# EAGLE design midi-servo (EAGLE 7.3.0)
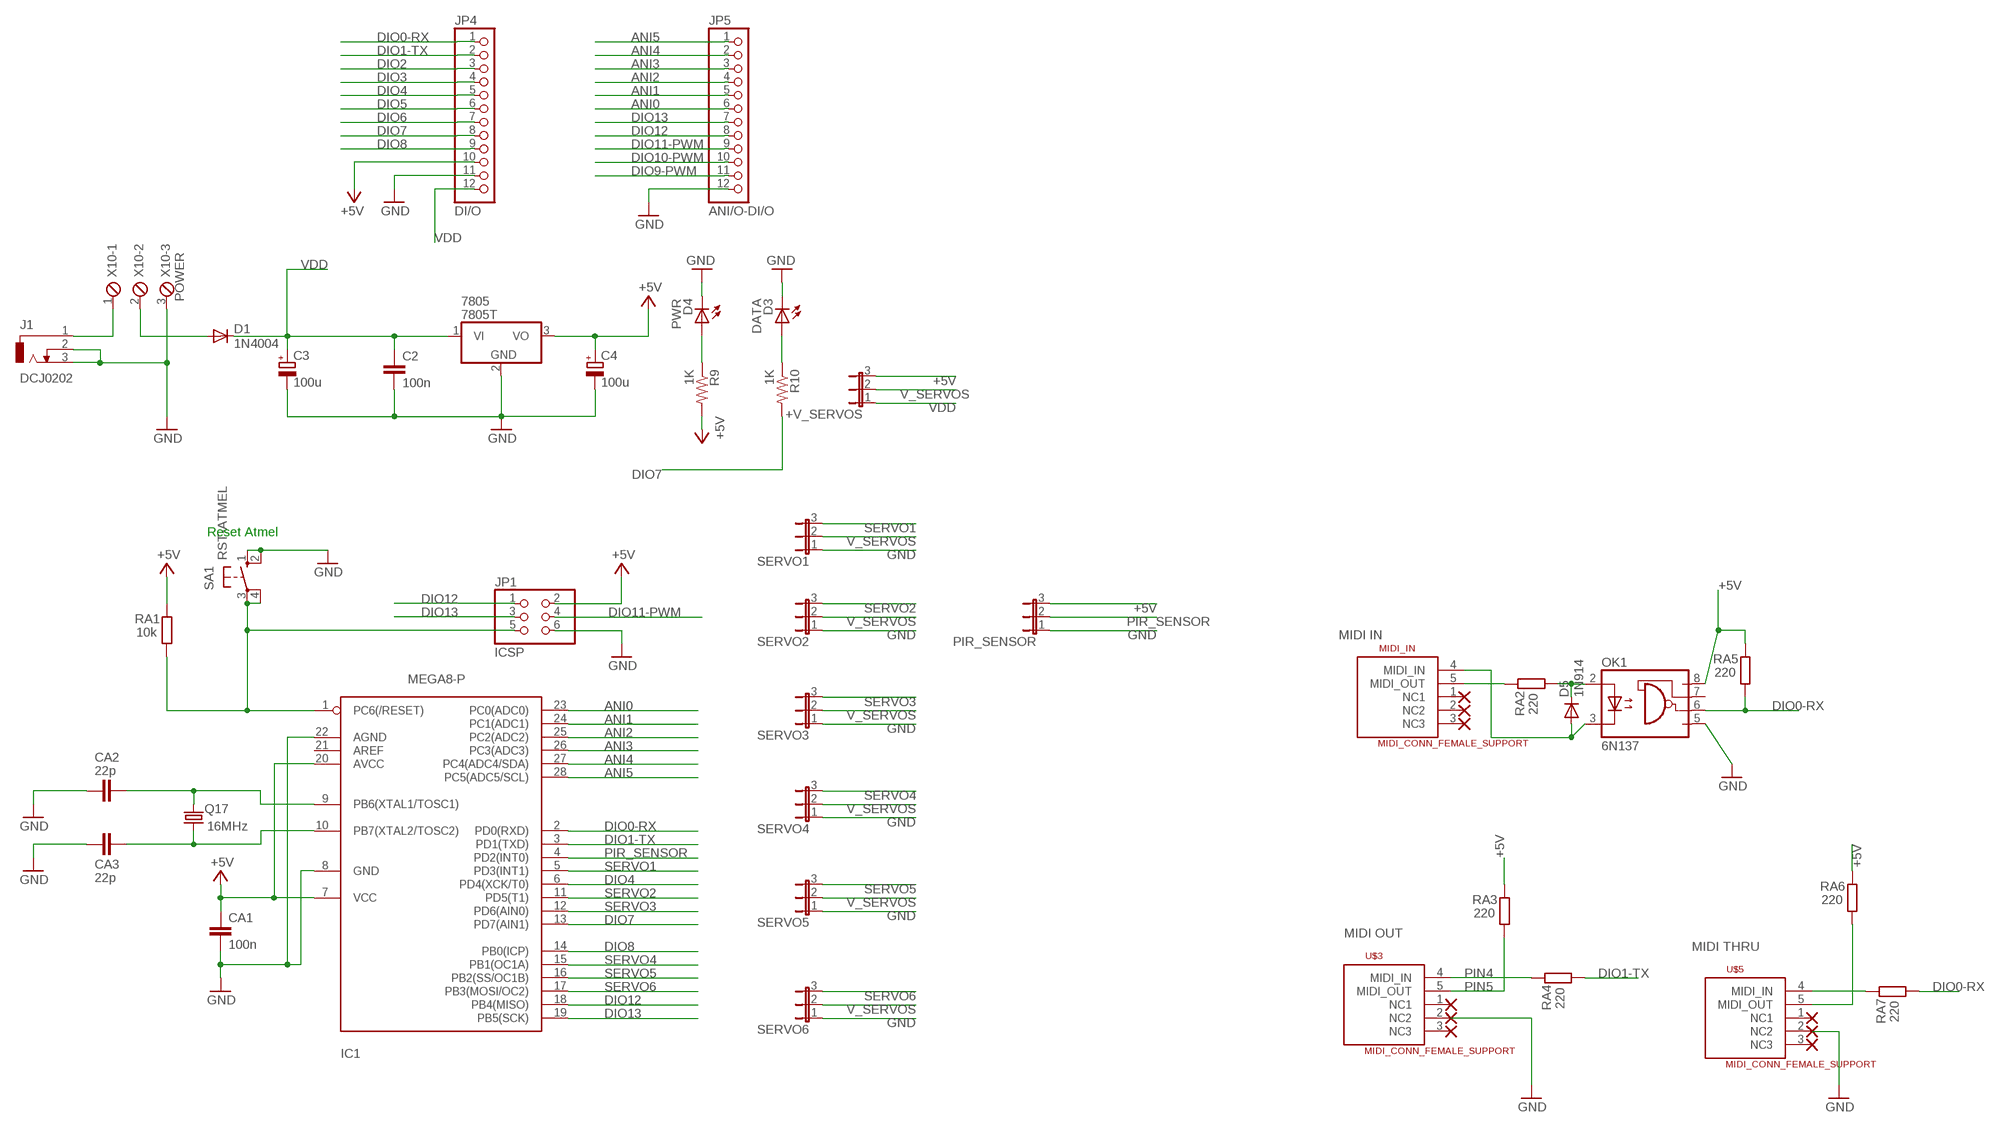
[diagram p0: schematic, sheet 1]

## Parts
7805  7805T  [TO220H]
+V_SERVOS  JP2E  [JP2]
C2  100n  C-EU050-025X075  [C050-025X075]
C3  100u  CPOL-EUE2.5-7  [E2,5-7]
C4  100u  CPOL-EUE2.5-7  [E2,5-7]
CA1  100n  C-EU050-025X075  [C050-025X075]
CA2  22p  C-EU050-025X075  [C050-025X075]
CA3  22p  C-EU050-025X075  [C050-025X075]
D1  1N4004  [DO41-10]
D3  DATA  HLMP-M  [LED4MM]
D4  PWR  HLMP-M  [LED4MM]
D5  1N914  BAS15  [DO34-7]
IC1  MEGA8-P  [DIL28-3]
J1  DCJ0202  [DCJ0202]
JP1  ICSP  PINHD-2X3  [2X03]
JP4  DI/O  PINHD-1X12  [1X12]
JP5  ANI/O-DI/O  PINHD-1X12  [1X12]
MIDI_IN  MIDI_CONN_FEMALE_SUPPORT  [DIN_5_FEMALE_SUPPORT]
OK1  6N137  [DIL08]
PIR_SENSOR  JP2E  [JP2]
Q17  16MHz  CRYSTALHC49S  [HC49/S]
R9  1K  R-US_0204/5  [0204/5]
R10  1K  R-US_0204/5  [0204/5]
RA1  10k  R-EU_0204/5  [0204/5]
RA2  220  R-EU_0204/5  [0204/5]
RA3  220  R-EU_0204/5  [0204/5]
RA4  220  R-EU_0204/5  [0204/5]
RA5  220  R-EU_0204/5  [0204/5]
RA6  220  R-EU_0204/5  [0204/5]
RA7  220  R-EU_0204/5  [0204/5]
SA1  RST-ATMEL  10-XX  [B3F-10XX]
SERVO1  JP2E  [JP2]
SERVO2  JP2E  [JP2]
SERVO3  JP2E  [JP2]
SERVO4  JP2E  [JP2]
SERVO5  JP2E  [JP2]
SERVO6  JP2E  [JP2]
U$3  MIDI_CONN_FEMALE_SUPPORT  [DIN_5_FEMALE_SUPPORT]
U$5  MIDI_CONN_FEMALE_SUPPORT  [DIN_5_FEMALE_SUPPORT]
X10  POWER  MPT3  [3POL254]

## Nets
56: D5.C OK1.2(A) RA2.2
1235: RA3.2 U$3.5(MIDI_OUT)
+5V [Power]: 7805.3(VO) +V_SERVOS.3 C4.+ CA1.1 IC1.7(VCC) IC1.20(AVCC) JP1.2 JP4.10 OK1.8(VCC) PIR_SENSOR.3 R9.2 RA1.1 RA3.1 RA5.1 RA6.1
ANI0: IC1.23(PC0(ADC0)) JP5.6
ANI1: IC1.24(PC1(ADC1)) JP5.5
ANI2: IC1.25(PC2(ADC2)) JP5.4
ANI3: IC1.26(PC3(ADC3)) JP5.3
ANI4: IC1.27(PC4(ADC4/SDA)) JP5.2
ANI5: IC1.28(PC5(ADC5/SCL)) JP5.1
DIO0-RX: IC1.2(PD0(RXD)) JP4.1 OK1.6(VO) RA5.2 RA7.2
DIO1-TX: IC1.3(PD1(TXD)) JP4.2 RA4.2
DIO2: JP4.3
DIO3: JP4.4
DIO4: IC1.6(PD4(XCK/T0)) JP4.5
DIO5: JP4.6
DIO6: JP4.7
DIO7: IC1.13(PD7(AIN1)) JP4.8 R10.2
DIO8: IC1.14(PB0(ICP)) JP4.9
DIO9-PWM: JP5.11
DIO10-PWM: JP5.10
DIO11-PWM: JP1.4 JP5.9
DIO12: IC1.18(PB4(MISO)) JP1.1 JP5.8
DIO13: IC1.19(PB5(SCK)) JP1.3 JP5.7
GND [GND]: 7805.2(GND) C2.2 C3.- C4.- CA1.2 CA2.2 CA3.2 D3.A(C) D4.A(C) IC1.8(GND) IC1.22(AGND) J1.2 J1.3 JP1.6 JP4.11 JP5.12 OK1.5(GND) PIR_SENSOR.1 SA1.1(S) SA1.2(S1) SERVO1.1 SERVO2.1 SERVO3.1 SERVO4.1 SERVO5.1 SERVO6.1 U$3.2(NC2) U$5.2(NC2) X10.3
N$1: J1.1 X10.1
N$2: IC1.1(PC6(/RESET)) JP1.5 RA1.2 SA1.3(P) SA1.4(P1)
N$4: D1.A X10.2
N$5: CA2.1 IC1.9(PB6(XTAL1/TOSC1)) Q17.2
N$6: CA3.1 IC1.10(PB7(XTAL2/TOSC2)) Q17.1
N$8: RA4.1 U$3.4(MIDI_IN)
N$9: RA6.2 U$5.5(MIDI_OUT)
N$13: RA7.1 U$5.4(MIDI_IN)
N$14: MIDI_IN.5(MIDI_OUT) RA2.1
N$21: D3.K(A) R10.1
N$25: D4.K(A) R9.1
PIN5: D5.A MIDI_IN.4(MIDI_IN) OK1.3(C)
PIR_SENSOR: IC1.4(PD2(INT0)) PIR_SENSOR.2
SERVO1: IC1.5(PD3(INT1)) SERVO1.3
SERVO2: IC1.11(PD5(T1)) SERVO2.3
SERVO3: IC1.12(PD6(AIN0)) SERVO3.3
SERVO4: IC1.15(PB1(OC1A)) SERVO4.3
SERVO5: IC1.16(PB2(SS/OC1B)) SERVO5.3
SERVO6: IC1.17(PB3(MOSI/OC2)) SERVO6.3
V_SERVOS: +V_SERVOS.2 SERVO1.2 SERVO2.2 SERVO3.2 SERVO4.2 SERVO5.2 SERVO6.2
VDD [Power]: 7805.1(VI) +V_SERVOS.1 C2.1 C3.+ D1.C JP4.12
Unconnected: IC1.21(AREF) MIDI_IN.1(NC1) MIDI_IN.2(NC2) MIDI_IN.3(NC3) OK1.7(VE) U$3.1(NC1) U$3.3(NC3) U$5.1(NC1) U$5.3(NC3)

## Notes on the sheet
- Reset Atmel
- MIDI IN
- MIDI OUT
- MIDI THRU
- PIN4
- PIN5

## Library data of the parts
7805 = linear:78*: Positive VOLTAGE REGULATOR Source: http://cache.national.com/ds/LM/LM78L05.pdf http://www.fairchildsemi.com/ds/LM/LM7805.pdf
+V_SERVOS PIR_SENSOR SERVO1-SERVO6 = jumper:JP2E: JUMPER
C2 CA1-CA3 = rcl:C-EU: CAPACITOR, European symbol
C3 C4 = rcl:CPOL-EU: POLARIZED CAPACITOR, European symbol
D1 = diode:1N4004: DIODE general purpose rectifier, 1 A
D3 D4 = CMC:HLMP-M: 4mm Flat Top LED flat top 4mm cylinder LED, Fairchild
D5 = diode:BAS15: DIODE high speed
IC1 = atmel:MEGA8-P: MICROCONTROLLER 8 Kbytes FLASH, 1 kbytes SRAM, 512 bytes EEPROM, USART, 4-channel 10 bit ADC, 2-channel 8 bit ADC Pin compatible with Atmega48, ATMega88, ATMega168 Source: avr.lbr
J1 = con-jack:DCJ0202: DC POWER JACK Source: DCJ0202.pdf
JP1 = pinhead:PINHD-2X3: PIN HEADER
JP4 JP5 = pinhead:PINHD-1X12: PIN HEADER
MIDI_IN U$3 U$5 = SparkFun:MIDI_CONN_FEMALE_SUPPORT
OK1 = optocoupler:6N137: MOTOROLA OPTO COUPLER; MPN: 6N137; OC_FARNELL: 1328376; OC_NEWARK: 52M1895
Q17 = crystal:CRYSTAL: CRYSTAL
R9 R10 = rcl-ez:R-US_: RESISTOR, American symbol
RA1-RA7 = rcl:R-EU_: RESISTOR, European symbol
SA1 = switch-omron:10-XX: OMRON SWITCH
X10 = con-phoenix-254:MPT3: PHOENIX CONNECTOR

## Net classes
0 default: width 0.406 mm, drill 0.508 mm, clearance 0.305 mm
1 GND: width 0.61 mm, drill 0.508 mm, clearance 0.305 mm
2 Power: width 0.61 mm, drill 0.508 mm, clearance 0.305 mm
3 AGND: width 0.61 mm, drill 0.508 mm, clearance 0.305 mm

## Board
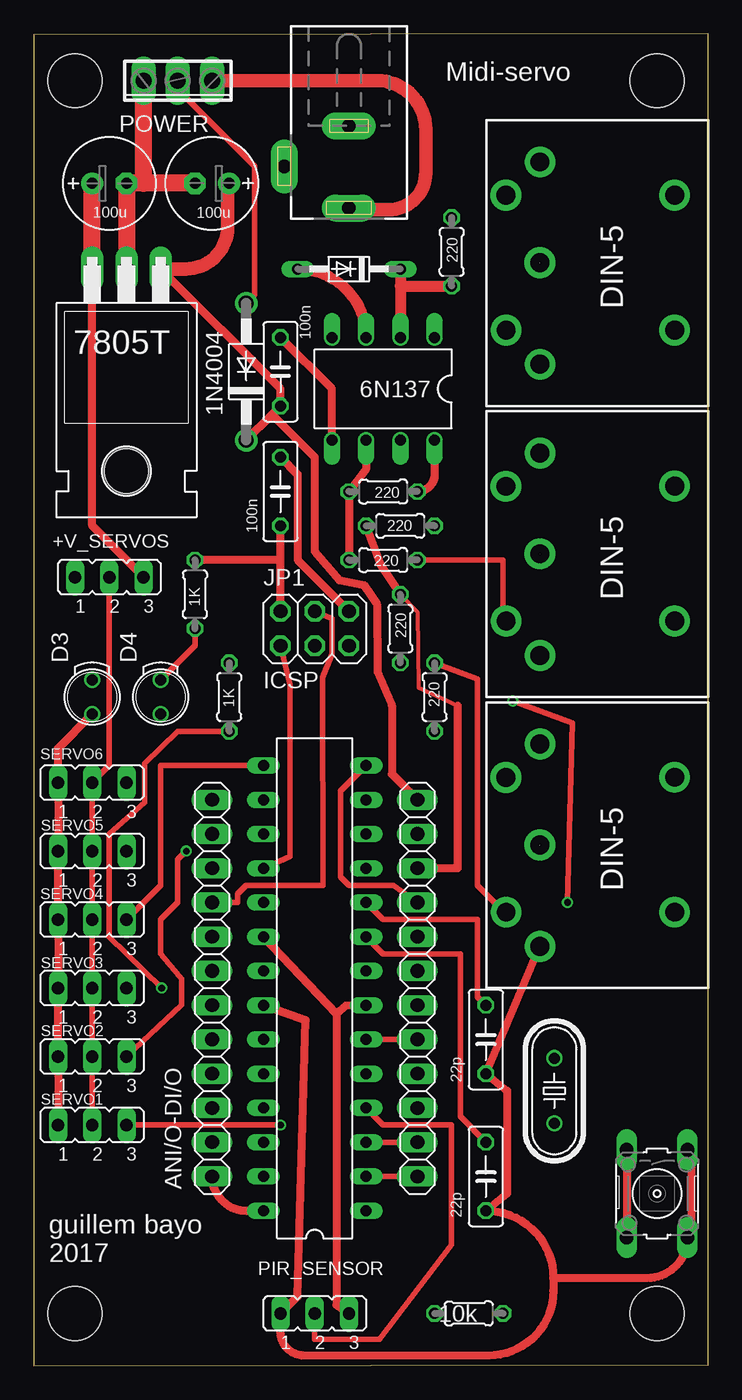
[diagram p1: board, top side]
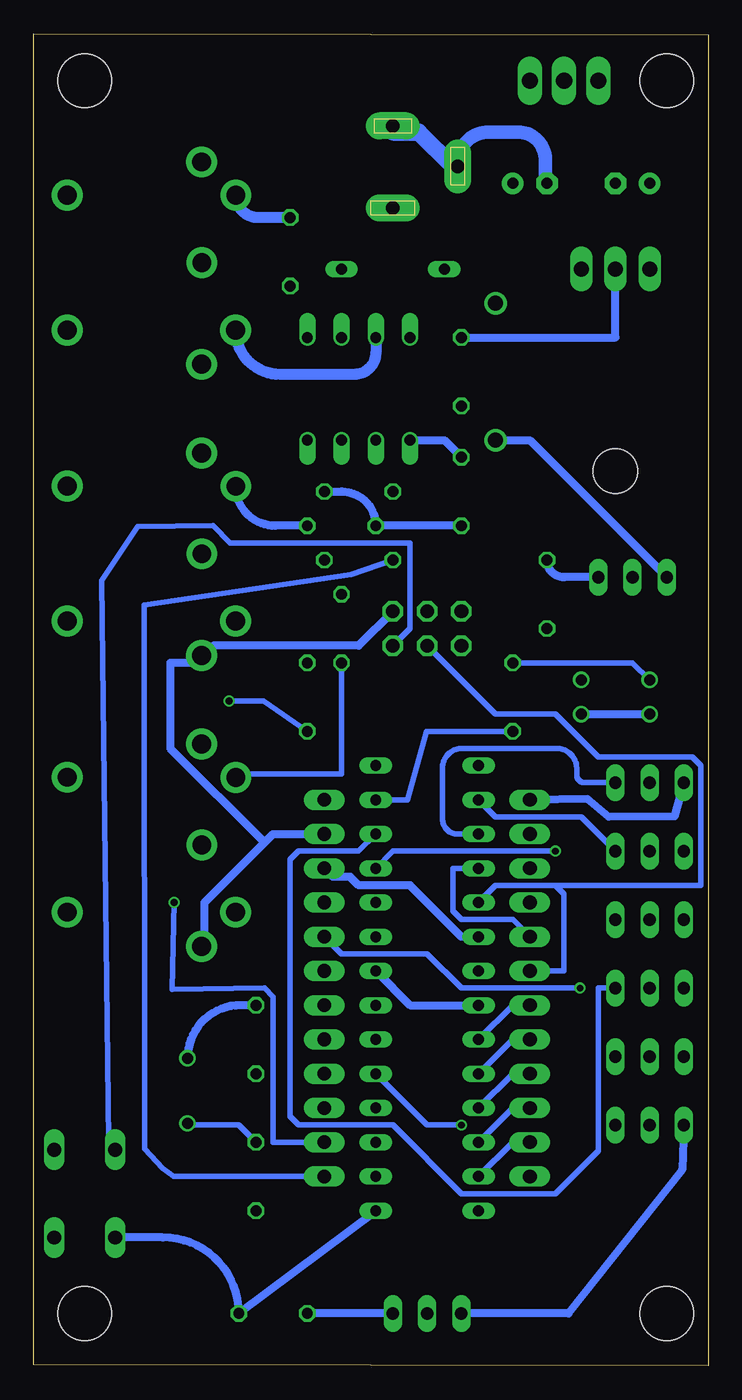
[diagram p2: board, bottom side, seen from below]

Size 50.04 x 98.8 mm. Coordinates in mm from the lower left corner, seen from the top.
Outline: 0,98.73 0,0 50.04,0.07 50.04,98.8 0,98.73
Copper layers (1*2*15*16): Top 0.035mm / dielectric 0.2mm / Route2 0.0175mm / dielectric 1.1mm / Route15 0.0175mm / dielectric 0.2mm / Bottom 0.035mm
Design rules "default": minimum track width 6mil, minimum drill 12mil, track to track 6mil, track to pad 6mil, pad to pad 6mil, via to via 6mil, smd to smd 0mil, copper to edge 10mil, drill to drill 10mil, minimum pad ring 6mil, minimum via ring 6mil, stop-mask expansion 2mil, vias tented up to drill 25mil, thermal gap 10mil
Holes 4 mm at 3.07,95.32 46.25,95.32 46.25,3.88 3.07,3.88

### Footprints (pad centres in the part's own frame; a part is rotated, then mirrored left to right if it is on the bottom)
TO220H = drill 1.118 long: 1 -2.54,-10.16; 2 0,-10.16; 3 2.54,-10.16 | hole 3.302: 0,4.826
JP2 = drill 0.914 long: 1 -2.54,0; 2 0,0; 3 2.54,0
C050-025X075 = drill 0.813 octagon: 1 -2.54,0; 2 2.54,0
E2,5-7 = drill 0.813 pad 1.6: + -1.27,0 | drill 0.813 pad 1.6 octagon: - 1.27,0
DO41-10 = drill 1.118: A 5.08,0; C -5.08,0
LED4MM = drill 0.813: A -1.27,0; K 1.27,0
DO34-7 = drill 0.813 long: A 3.81,0; C -3.81,0
DIL28-3 = drill 0.813 long: 1 -16.51,-3.81; 2 -13.97,-3.81; 3 -11.43,-3.81; 4 -8.89,-3.81; 5 -6.35,-3.81; 6 -3.81,-3.81; 7 -1.27,-3.81; 8 1.27,-3.81; 9 3.81,-3.81; 10 6.35,-3.81; 11 8.89,-3.81; 12 11.43,-3.81; 13 13.97,-3.81; 14 16.51,-3.81; 15 16.51,3.81; 16 13.97,3.81; 17 11.43,3.81; 18 8.89,3.81; 19 6.35,3.81; 20 3.81,3.81; 21 1.27,3.81; 22 -1.27,3.81; 23 -3.81,3.81; 24 -6.35,3.81; 25 -8.89,3.81; 26 -11.43,3.81; 27 -13.97,3.81; 28 -16.51,3.81
DCJ0202 = drill 1 pad 2 long: 1 0,3.1; 2 4.8,0; 3 0,-3
2X03 = drill 1.016 octagon: 1 -2.54,-1.27; 2 -2.54,1.27; 3 0,-1.27; 4 0,1.27; 5 2.54,-1.27; 6 2.54,1.27
1X12 = drill 1.016 long: 1 -13.97,0; 2 -11.43,0; 3 -8.89,0; 4 -6.35,0; 5 -3.81,0; 6 -1.27,0; 7 1.27,0; 8 3.81,0; 9 6.35,0; 10 8.89,0; 11 11.43,0; 12 13.97,0
DIN_5_FEMALE_SUPPORT = drill 1.4 pad 2.286: 1 0.46,3.61; 2 -7.07,3.6; 3 7.94,3.6; 4 -4.53,6.12; 5 5.47,6.13; 6 -4.53,-6.382; 7 5.478,-6.382
DIL08 = drill 0.813 offset: 1 -3.81,-3.81; 2 -1.27,-3.81; 3 1.27,-3.81; 4 3.81,-3.81; 5 3.81,3.81; 6 1.27,3.81; 7 -1.27,3.81; 8 -3.81,3.81
HC49/S = drill 0.813: 1 -2.413,0; 2 2.413,0
0204/5 = drill 0.813 octagon: 1 -2.54,0; 2 2.54,0
B3F-10XX = drill 1.016 long: 1 -3.251,2.261; 2 3.251,2.261; 3 -3.251,-2.261; 4 3.251,-2.261
3POL254 = drill 1.2 long: 1 -2.54,0; 2 0,0; 3 2.54,0

### Placement (x,y rotation side)
7805  6.88,71.19 180 top
+V_SERVOS  5.61,58.49 0 top
C2  18.31,73.73 90 top
C3  13.23,87.7 180 top
C4  5.61,87.7 0 top
CA1  18.31,64.84 90 top
CA2  33.55,14.04 270 top
CA3  33.55,24.2 270 top
D1  15.77,73.73 90 top
D3  4.34,49.6 90 top
D4  9.42,49.6 90 top
D5  23.39,81.35 180 top
IC1  20.85,28.01 90 top
J1  23.39,88.97 180 top
JP1  20.85,54.68 0 top
JP4  28.47,28.01 90 top
JP5  13.23,28.01 90 top
MIDI_IN  41.17,81.35 90 top
OK1  25.93,72.46 180 top
PIR_SENSOR  20.85,3.88 0 top
Q17  38.63,20.39 270 top
R9  11.96,57.22 90 top
R10  14.5,49.6 270 top
RA1  32.28,3.88 0 top
RA2  31.01,82.62 270 top
RA3  27.2,54.68 270 top
RA4  29.74,49.6 270 top
RA5  25.93,64.84 180 top
RA6  27.2,62.3 0 top
RA7  25.93,59.76 180 top
SA1  46.25,12.77 270 top
SERVO1  4.34,17.85 0 top
SERVO2  4.34,22.93 0 top
SERVO3  4.34,28.01 0 top
SERVO4  4.34,33.09 0 top
SERVO5  4.34,38.17 0 top
SERVO6  4.34,43.25 0 top
U$3  41.17,38.17 90 top
U$5  41.17,59.76 90 top
X10  10.69,95.32 180 top

### Tracks (layer width: path | path; a pad name or v marks a point on that pad's centre or on a via)
56
  Top 0.813: D5.C 27.2,80.08 | 27.2,80.08 OK1.2 | 27.2,80.08 RA2.2
1235
  Bottom 0.406: RA3.2 27.2,43.89 34.82,43.89 U$3.5
+5V
  Top 0.305: 31.44,48.97 28.56,50.3 28.47,55.91 RA3.1
  Top 0.61: 22.46,26.11 IC1.20 | 22.46,26.11 23.15,26.71 IC1.7 | PIR_SENSOR.3 22.46,4.52 22.46,26.11 | RA3.1 25.82,59.29 RA6.1 | JP1.2 18.31,59.76 | 18.31,59.76 CA1.1 | 18.31,59.76 R9.2 | 7805.3 4.34,62.3 +V_SERVOS.3 | JP4.10 31.44,36.9 31.44,48.97 | OK1.8 29.74,66.11 arc-90 RA5.1
  Top 1.27: 7805.3 C4.+
  Bottom 0.61: PIR_SENSOR.3 RA1.1 | JP4.10 27.84,36.27 26.57,36.27 25.93,35.63 22.12,35.63 18.31,31.82 IC1.20 | CA1.1 RA6.1 arc-90 27.2,64.84 RA5.1 | +V_SERVOS.3 10.69,58.49 arc90 R9.2
ANI0
  Bottom 0.406: IC1.23 14.5,26.74 JP5.6
ANI1
  Bottom 0.406: IC1.24 14.5,24.2 JP5.5
ANI2
  Bottom 0.406: IC1.25 14.5,21.66 JP5.4
ANI3
  Bottom 0.406: IC1.26 14.5,19.12 JP5.3
ANI4
  Bottom 0.406: IC1.27 14.5,16.58 JP5.2
ANI5
  Top 0.61: JP5.1 arc90 15.77,11.5 IC1.28
DIO0-RX
  Top 0.406: JP4.1 IC1.2
  Top 0.61: RA7.2 RA5.2 24.68,66.57 OK1.6
  Bottom 0.406: JP4.1 39.66,14.06 40.46,14.65 41.8,16.11 41.86,56.44 26.5,58.7 RA7.2
DIO1-TX  (via drill 0.51)
  Top 0.406: JP4.2 IC1.3 | v35.54,49.32 39.95,47.66 v39.61,34.36
  Bottom 0.406: RA4.2 32.98,49.31 v35.54,49.32 | v39.61,34.36 39.78,27.93 32.92,28.01 32.28,27.38 32.28,16.58 JP4.2
DIO4
  Top 0.406: JP4.5 IC1.6
DIO7  (via drill 0.51)
  Top 0.406: v9.5,28.01 5.61,31.82 5.61,39.44 8.23,41.77 8.23,44.69 10.69,47.06 R10.2
  Bottom 0.406: R10.2 20.92,47.05 22.32,41.99 IC1.13 | JP4.8 27.2,30.55 20.85,30.55 18.31,28.01 v9.5,28.01
DIO8
  Top 0.406: IC1.14 22.76,42.62 22.76,36.27 23.39,35.63 26.71,35.63 JP4.9
DIO11-PWM
  Top 0.406: JP5.9 15.14,34.36 15.14,35 15.77,35.63 21.49,35.63 21.44,51.06 22.12,52.78 22.12,55.44 JP1.4
DIO12
  Top 0.406: IC1.18 19.03,37.76 19.03,50.48 JP1.1
  Bottom 0.406: JP5.8 14.5,33.09 18.31,33.09 18.95,33.73 18.95,36.9 IC1.18
DIO13
  Bottom 0.406: IC1.19 15.77,35.63 11.33,35.63 | 11.33,35.63 10.69,35 10.69,29.28 JP5.7 | JP1.3 15.77,48.33 11.33,48.33 8.15,45.16 1.17,45.16 0.53,44.52 0.53,35.63 11.33,35.63
GND
  Top 0.61: D3.A 1.8,45.79 SERVO6.1 SERVO5.1 SERVO4.1 SERVO3.1 SERVO2.1 SERVO1.1 | IC1.22 20.18,25.62 19.58,5.15 PIR_SENSOR.1 18.31,2.52 arc90 20.07,0.76 33.74,0.76 arc90 38.56,5.58 38.56,6.5 | SA1.1 48.79,15.95 48.79,9.6 SA1.2 arc-90 45.49,6.5 38.56,6.5 | C2.2 22.12,72.46 OK1.5 | JP1.6 19.58,59.76 19.58,66.11 CA1.2 | 38.56,6.5 arc90 CA2.2 35.12,12.77 35.12,20.39 CA3.2 U$3.2
  Top 1.27: C3.- 8.15,87.7 | 8.15,87.7 C4.- 7805.2 | 8.15,87.7 X10.3
  Bottom 0.61: D4.A D3.A | JP5.12 8.95,42.03 7.38,40.71 2.5,40.75 SERVO6.1 | IC1.22 22.12,26.74 IC1.8 | PIR_SENSOR.1 10.36,3.88 1.93,14.54 SERVO1.1 | JP4.11 32.28,39.44 32.92,38.81 | 32.92,38.81 37.36,34.36 37.36,31.19 U$3.2 | 23.39,91.51 J1.3 | CA1.2 19.58,68.65 OK1.5 | JP1.6 25.93,53.41 36.73,53.41 37.36,52.78 U$5.2 38,52.14 39.9,52.14 39.9,45.79 32.92,38.81 | 7805.2 6.88,76.27 C2.2
  Bottom 1.016: J1.2 18.59,89.2 arc90 16.28,91.51 14.13,91.51 arc90 12.07,89.45 12.07,87.81 arc-90 C3.-
  Bottom 1.27: 23.39,91.51 21.49,91.51 18.95,88.97 J1.2
N$1
  Top 1.016: X10.1 25.46,95.32 arc-90 29.1,91.68 29.1,88.5 arc-90 26.34,85.75 23.52,85.75 arc-90 J1.1
N$2
  Top 0.61: SA1.3 SA1.4
  Bottom 0.406: JP1.5 22.12,54.68 22.12,61.03 35.46,61.03 36.73,62.3 42.33,62.25 45,58.25 44.49,16.58 SA1.3
  Bottom 0.61: IC1.1 RA1.2 arc-90 40.46,9.52 SA1.4
N$4
  Top 0.406: D1.A 16.41,79.45 16.41,88.97 10.69,94.69 X10.2
N$5
  Top 0.406: IC1.9 25.93,30.55 31.65,30.55 31.65,18.49 CA2.1
  Bottom 0.406: CA2.1 34.82,17.85 38.63,17.85 Q17.2
N$6
  Top 0.406: IC1.10 25.93,33.09 32.92,33.09 32.92,27.38 CA3.1
  Bottom 0.61: CA3.1 34.69,26.74 arc-90 Q17.1
N$8
  Top 0.406: RA4.1 32.92,50.95 32.92,35.63 34.82,33.73 U$3.4
N$9
  Bottom 0.61: RA6.2 32.11,62.3 arc90 U$5.5
N$13
  Top 0.406: RA7.1 34.82,59.76 34.82,55.32 U$5.4
N$14
  Bottom 0.813: RA2.1 33.38,85.16 arc90 MIDI_IN.5
N$21
  Bottom 0.406: D3.K 5.61,52.14 R10.1
N$25
  Top 0.406: D4.K 11.96,53.41 R9.1
PIN5
  Top 0.813: D5.A arc-90 OK1.3
  Bottom 0.813: OK1.3 24.66,75.13 arc90 26.26,73.53 31.76,73.53 arc90 MIDI_IN.4
PIR_SENSOR
  Top 0.406: IC1.4 25.93,17.85 31.01,17.85 31.01,8.96 25.66,1.98 20.85,1.98 PIR_SENSOR.2
SERVO1  (via drill 0.51)
  Top 0.406: SERVO1.3 v18.31,17.85
  Bottom 0.406: IC1.5 20.85,17.85 v18.31,17.85
SERVO2  (via drill 0.51)
  Top 0.406: v11.33,38.17 10.69,37.54 10.69,34.36 9.42,33.09 9.42,30.55 10.99,28.69 10.99,26.78 SERVO2.3
  Bottom 0.406: IC1.11 23.39,38.17 v11.33,38.17
SERVO3
  Bottom 0.406: IC1.12 25.93,38.17 30.38,38.17 31.01,37.54 31.01,18.49 30.38,17.85 23.39,17.85 18.31,12.77 11.33,12.77 8.15,15.95 8.15,28.01 SERVO3.3
SERVO4
  Top 0.406: IC1.15 9.42,44.52 9.42,35.63 SERVO4.3
SERVO5
  Bottom 0.406: IC1.16 15.77,40.71 9.42,40.71 SERVO5.3
SERVO6
  Bottom 0.406: SERVO6.3 9.17,43.25 arc90 9.75,43.83 9.75,44.21 arc-90 11.18,45.8 18.33,45.8 arc-90 19.71,44.25 19.71,40.57 arc-90 18.58,39.44 IC1.17 arc-90 IC1.17
V_SERVOS
  Top 0.406: SERVO1.2 SERVO2.2 SERVO3.2 SERVO4.2 SERVO5.2 SERVO6.2 5.61,44.52 +V_SERVOS.2
VDD
  Top 0.61: D1.C 17.68,70.56 | 17.68,70.56 C2.1 18.31,72.46 7805.1 | JP4.12 26.57,43.89 26.57,48.98 25.51,51.46 25.47,56.5 24.51,57.89 22.67,58.28 20.85,60.4 20.85,67.38 17.68,70.56
  Top 1.016: 7805.1 11.28,81.35 arc90 14.39,84.46 14.39,87.59 arc-90 C3.+
  Bottom 0.61: +V_SERVOS.1 13.23,68.65 D1.C

### Text on the board
tNames: Midi-servo | guillem bayo / 2017